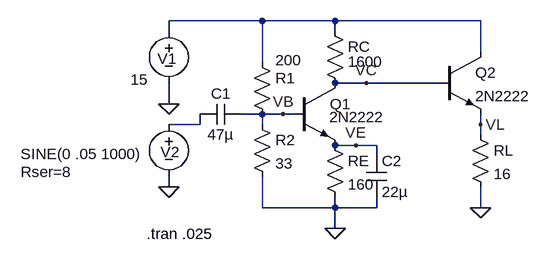
[diagram p0: schematic cecc.asc]
cecc.asc, the LTspice schematic file:
Version 4
SHEET 1 1160 680
WIRE -64 -112 -208 -112
WIRE 48 -112 -64 -112
WIRE 272 -112 48 -112
WIRE -208 -96 -208 -112
WIRE 48 -96 48 -112
WIRE 272 -64 272 -112
WIRE -64 -48 -64 -112
WIRE 96 -16 48 -16
WIRE 208 -16 96 -16
WIRE -208 16 -208 -16
WIRE -64 32 -96 32
WIRE -32 32 -64 32
WIRE -16 32 -32 32
WIRE -160 48 -160 32
WIRE -160 48 -208 48
WIRE -64 48 -64 32
WIRE 272 48 272 32
WIRE 272 64 272 48
WIRE 80 80 48 80
WIRE 112 80 80 80
WIRE 112 96 112 80
WIRE -208 144 -208 128
WIRE -64 176 -64 128
WIRE 48 176 48 160
WIRE 48 176 -64 176
WIRE 112 176 112 160
WIRE 112 176 48 176
WIRE 272 176 272 144
WIRE 48 208 48 176
FLAG 48 208 0
FLAG -208 16 0
FLAG -208 144 0
FLAG -32 32 VB
FLAG 272 176 0
FLAG 96 -16 VC
FLAG 80 80 VE
FLAG 272 48 VL
SYMBOL npn -16 -16 R0
WINDOW 3 55 52 Left 2
SYMATTR InstName Q1
SYMATTR Value 2N2222
SYMBOL res -80 -64 R0
WINDOW 3 36 13 Left 2
SYMATTR InstName R1
SYMATTR Value 200
SYMBOL res -80 32 R0
SYMATTR InstName R2
SYMATTR Value 33
SYMBOL res 32 64 R0
SYMATTR InstName RE
SYMATTR Value 160
SYMBOL res 32 -112 R0
WINDOW 3 36 63 Left 2
SYMATTR InstName RC
SYMATTR Value 1600
SYMBOL cap -96 16 R90
WINDOW 0 0 32 VBottom 2
WINDOW 3 32 32 VTop 2
SYMATTR InstName C1
SYMATTR Value 47µ
SYMBOL voltage -208 -112 R0
WINDOW 0 -17 58 Left 2
WINDOW 3 -59 91 Left 2
WINDOW 123 0 0 Left 2
WINDOW 39 0 0 Left 2
SYMATTR InstName V1
SYMATTR Value 15
SYMBOL voltage -208 32 R0
WINDOW 0 -13 58 Left 2
WINDOW 3 -228 61 Left 2
WINDOW 123 0 0 Left 2
WINDOW 39 -228 89 Left 2
SYMATTR InstName V2
SYMATTR Value SINE(0 .05 1000)
SYMATTR SpiceLine Rser=8
SYMBOL npn 208 -64 R0
SYMATTR InstName Q2
SYMATTR Value 2N2222
SYMBOL res 256 48 R0
SYMATTR InstName RL
SYMATTR Value 16
SYMBOL cap 96 96 R0
SYMATTR InstName C2
SYMATTR Value 22µ
TEXT -242 216 Left 2 !.tran .025

The netlist it stands for:
* cecc.asc
Q1 VC VB VE 0 2N2222
R1 N001 VB 200
R2 VB 0 33
RE VE 0 160
RC N001 VC 1600
C1 VB N002 47µ
V1 N001 0 15
V2 N002 0 SINE(0 .05 1000) Rser=8
Q2 N001 VC VL 0 2N2222
RL VL 0 16
C2 VE 0 22µ
.model NPN NPN
.model PNP PNP
.lib standard.bjt
.tran .025
.backanno
.end